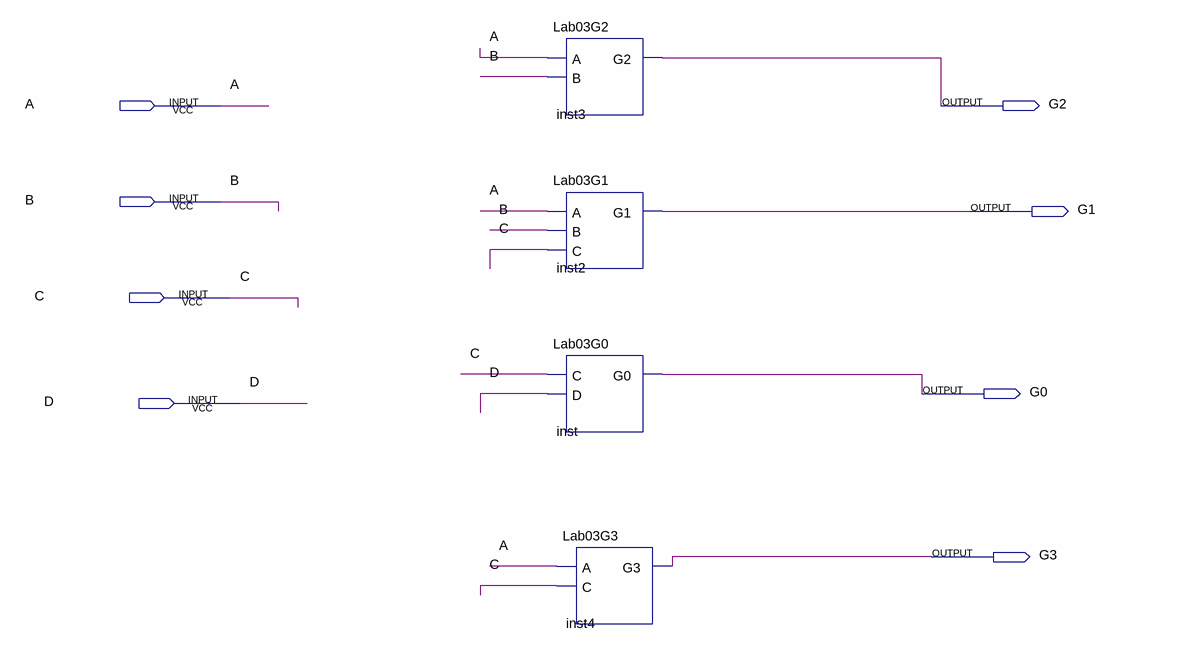
[diagram p0: schematic sheet]
// Quartus schematic lab03Task01.bdf as structural Verilog: 4 symbols, 8 pins
module lab03Task01 (
  input  A,
  input  B,
  input  C,
  input  D,
  output G2,
  output G1,
  output G0,
  output G3
);

  Lab03G2 inst3 (.A(A), .B(B), .G2(G2));
  Lab03G1 inst2 (.A(A), .B(B), .C(C), .G1(G1));
  Lab03G0 inst (.C(C), .D(D), .G0(G0));
  Lab03G3 inst4 (.A(A), .C(C), .G3(G3));
endmodule
